# Altium schematic sheet NSSTC-BAK.SchDoc
size A4
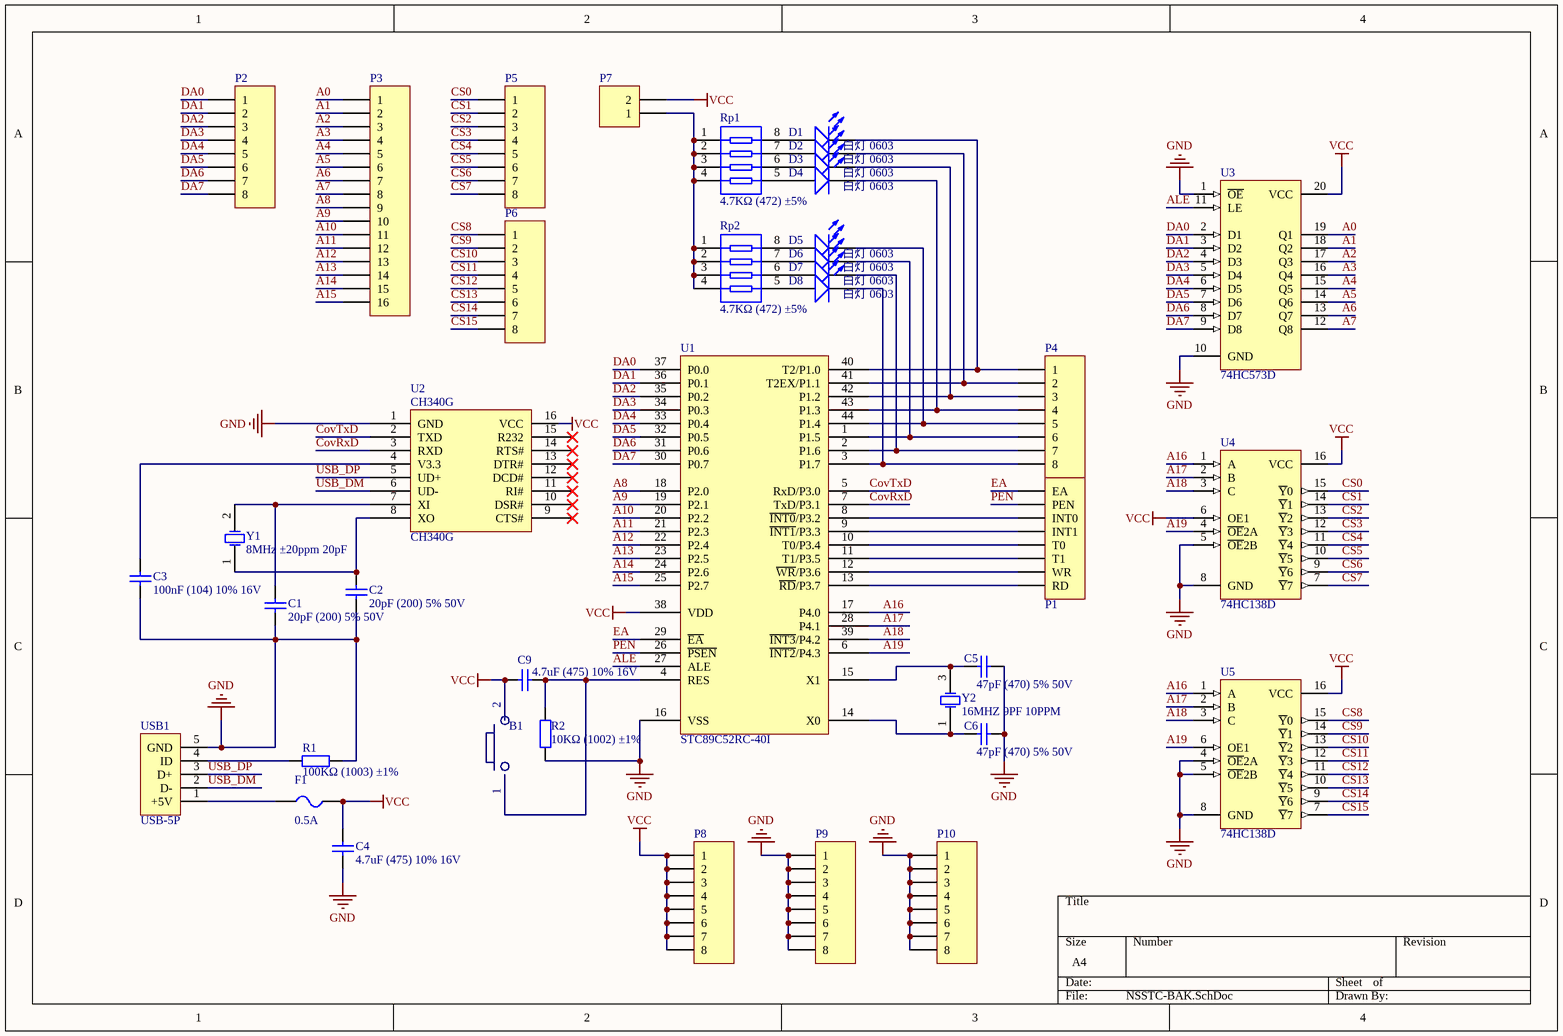
[diagram p0: NSSTC-BAK.SchDoc]

## Parts
B1  B?  [MetalButton]  (value not drawn)
C1  20pF (200) 5% 50V  [0402_C]
C2  20pF (200) 5% 50V  [0402_C]
C3  100nF (104) 10% 16V  [0402_C]
C4  4.7uF (475) 10% 16V  [0603_C]
C5  47pF (470) 5% 50V  [0402_C]
C6  47pF (470) 5% 50V  [0402_C]
C9  4.7uF (475) 10% 16V  [0603_C]
D1  白灯 0603  [0603_LED_S1]
D2  白灯 0603  [0603_LED_S1]
D3  白灯 0603  [0603_LED_S1]
D4  白灯 0603  [0603_LED_S1]
D5  白灯 0603  [0603_LED_S1]
D6  白灯 0603  [0603_LED_S1]
D7  白灯 0603  [0603_LED_S1]
D8  白灯 0603  [0603_LED_S1]
F1  0.5A  [FU 0603]
P1  Header 8  [HDR1X8]  (value not drawn)
P2  Header 8  [HDR1X8]  (value not drawn)
P3  Header 16  [HDR1X16]  (value not drawn)
P4  Header 8  [HDR1X8]  (value not drawn)
P5  Header 8  [HDR1X8]  (value not drawn)
P6  Header 8  [HDR1X8]  (value not drawn)
P7  Header 2  [HDR1X2]  (value not drawn)
P8  Header 8  [HDR1X8]  (value not drawn)
P9  Header 8  [HDR1X8]  (value not drawn)
P10  Header 8  [HDR1X8]  (value not drawn)
R1  100KΩ (1003) ±1%  [0402_R]
R2  10KΩ (1002) ±1%  [0402_R]
Rp1  4.7KΩ (472) ±5%  [0603_Rx4]
Rp2  4.7KΩ (472) ±5%  [0603_Rx4]
U1  STC89C52RC-40I  [LQFP-44_10x10x08P]
U2  CH340G  [SOIC-16_150mil]
U3  74HC573D  [SOIC-20_300mil]
U4  74HC138D  [SOIC-16_150mil]
U5  74HC138D  [SOIC-16_150mil]
USB1  USB-5P  [USB-MICRO_D]
Y1  8MHz ±20ppm 20pF  [SMD-5032_2P]
Y2  16MHZ 9PF 10PPM  [SMD-3225_4P]

## Nets
GND: C1.1 C2.1 C3.1 C4.1 C5.2 C6.2 P9.1 P9.2 P9.3 P9.4 P9.5 P9.6 P9.7 P9.8 P10.1 P10.2 P10.3 P10.4 P10.5 P10.6 P10.7 P10.8 R1.2 R2.1 U1.16(VSS) U2.1(GND) U3.1(~{OE}) U3.10(GND) U4.5(~{OE}2B) U4.8(GND) U5.4(~{OE}2A) U5.5(~{OE}2B) U5.8(GND) USB1.5(GND)
VCC: B1.2 C4.2 C9.2 F1.1 P7.2 P8.1 P8.2 P8.3 P8.4 P8.5 P8.6 P8.7 P8.8 U1.38(VDD) U2.16(VCC) U3.20(VCC) U4.6(OE1) U4.16(VCC) U5.16(VCC)
A0: P3.1 U3.19(Q1)
A1: P3.2 U3.18(Q2)
A2: P3.3 U3.17(Q3)
A3: P3.4 U3.16(Q4)
A4: P3.5 U3.15(Q5)
A5: P3.6 U3.14(Q6)
A6: P3.7 U3.13(Q7)
A7: P3.8 U3.12(Q8)
A8: P3.9 U1.18(P2.0)
A9: P3.10 U1.19(P2.1)
A10: P3.11 U1.20(P2.2)
A11: P3.12 U1.21(P2.3)
A12: P3.13 U1.22(P2.4)
A13: P3.14 U1.23(P2.5)
A14: P3.15 U1.24(P2.6)
A15: P3.16 U1.25(P2.7)
A16: U1.17(P4.0) U4.1(A) U5.1(A)
A17: U1.28(P4.1) U4.2(B) U5.2(B)
A18: U1.39(~{INT3}/P4.2) U4.3(C) U5.3(C)
A19: U1.6(~{INT2}/P4.3) U4.4(~{OE}2A) U5.6(OE1)
ALE: U1.27(ALE) U3.11(LE)
CovRxD: U1.7(TxD/P3.1) U2.3(RXD)
CovTxD: U1.5(RxD/P3.0) U2.2(TXD)
CS0: P5.1 U4.15(~{Y}0)
CS1: P5.2 U4.14(~{Y}1)
CS2: P5.3 U4.13(~{Y}2)
CS3: P5.4 U4.12(~{Y}3)
CS4: P5.5 U4.11(~{Y}4)
CS5: P5.6 U4.10(~{Y}5)
CS6: P5.7 U4.9(~{Y}6)
CS7: P5.8 U4.7(~{Y}7)
CS8: P6.1 U5.15(~{Y}0)
CS9: P6.2 U5.14(~{Y}1)
CS10: P6.3 U5.13(~{Y}2)
CS11: P6.4 U5.12(~{Y}3)
CS12: P6.5 U5.11(~{Y}4)
CS13: P6.6 U5.10(~{Y}5)
CS14: P6.7 U5.9(~{Y}6)
CS15: P6.8 U5.7(~{Y}7)
DA0: P2.1 U1.37(P0.0) U3.2(D1)
DA1: P2.2 U1.36(P0.1) U3.3(D2)
DA2: P2.3 U1.35(P0.2) U3.4(D3)
DA3: P2.4 U1.34(P0.3) U3.5(D4)
DA4: P2.5 U1.33(P0.4) U3.6(D5)
DA5: P2.6 U1.32(P0.5) U3.7(D6)
DA6: P2.7 U1.31(P0.6) U3.8(D7)
DA7: P2.8 U1.30(P0.7) U3.9(D8)
EA: P1.1(EA) U1.29(~{EA})
PEN: P1.2(PEN) U1.26(~{PSEN})
USB_DM: U2.6(UD-) USB1.2(D-)
USB_DP: U2.5(UD+) USB1.3(D+)
NetB1_1: B1.1 C9.1 R2.2 U1.4(RES)
NetC1_2: C1.2 U2.7(XI) Y1.2(OSC2)
NetC2_2: C2.2 U2.8(XO) Y1.1(OSC1)
NetC3_2: C3.2 U2.4(V3.3)
NetC5_1: C5.1 U1.15(X1) Y2.3(OSC2)
NetC6_1: C6.1 U1.14(X0) Y2.1(OSC1)
NetD1_A: D1.A Rp1.8
NetD1_K: D1.K P4.1 U1.40(T2/P1.0)
NetD2_A: D2.A Rp1.7
NetD2_K: D2.K P4.2 U1.41(T2EX/P1.1)
NetD3_A: D3.A Rp1.6
NetD3_K: D3.K P4.3 U1.42(P1.2)
NetD4_A: D4.A Rp1.5
NetD4_K: D4.K P4.4 U1.43(P1.3)
NetD5_A: D5.A Rp2.8
NetD5_K: D5.K P4.5 U1.44(P1.4)
NetD6_A: D6.A Rp2.7
NetD6_K: D6.K P4.6 U1.1(P1.5)
NetD7_A: D7.A Rp2.6
NetD7_K: D7.K P4.7 U1.2(P1.6)
NetD8_A: D8.A Rp2.5
NetD8_K: D8.K P4.8 U1.3(P1.7)
NetF1_2: F1.2 USB1.1(+5V)
NetP1_3: P1.3(INT0) U1.8(~{INT0}/P3.2)
NetP1_4: P1.4(INT1) U1.9(~{INT1}/P3.3)
NetP1_5: P1.5(T0) U1.10(T0/P3.4)
NetP1_6: P1.6(T1) U1.11(T1/P3.5)
NetP1_7: P1.7(WR) U1.12(~{WR}/P3.6)
NetP1_8: P1.8(RD) U1.13(~{RD}/P3.7)
NetP7_1: P7.1 Rp1.1 Rp1.2 Rp1.3 Rp1.4 Rp2.1 Rp2.2 Rp2.3 Rp2.4
NetR1_1: R1.1 USB1.4(ID)

Not connected (* = marked no-connect by the designer): U2 9(CTS#)* 10(DSR#)* 11(RI#)* 12(DCD#)* 13(DTR#)* 14(RTS#)* 15(R232)*

## Library data of the parts
B1 = MetalButton
C1 C2 = 0402 20pF (200) 5% 50V: 贴片电容; ComponentLink1Description: 供应商链接; ComponentLink1URL: http://www.szlcsc.com/product/details_1906.html; Package: 0402; Supplier: LC; SuppliersPartNumber: C1554
C3 = 0402 100nF (104) 10% 16V: 贴片电容; ComponentLink1Description: 供应商链接; ComponentLink1URL: http://www.szlcsc.com/product/details_1877.html; Package: 0402; Supplier: LC; SuppliersPartNumber: C1525
C4 C9 = 0603 4.7uF (475) 10% 16V: 贴片电容; ComponentLink1Description: 供应商链接; ComponentLink1URL: http://www.szlcsc.com/product/details_20375.html; Package: 0603; Supplier: LC; SuppliersPartNumber: C19666
C5 C6 = 0402 47pF (470) 5% 50V: 贴片电容; ComponentLink1Description: 供应商链接; ComponentLink1URL: http://www.szlcsc.com/product/details_1919.html; Package: 0402; Supplier: LC; SuppliersPartNumber: C1567
D1-D8 = 0603 白灯: 发光二极管; ComponentLink1Description: 供应商链接; ComponentLink1URL: http://www.szlcsc.com/product/details_2663.html; Package: 0603; Supplier: LC; SuppliersPartNumber: C2290
F1 = FU: 贴片保险丝; 版权归属: 源创客; BOM名称: 贴片保险丝; 学习资源: www.ooocke.com
P1 P2 P4-P6 P8-P10 = Header 8: Header, 8-Pin; LatestRevisionDate: 17-Jul-2002; LatestRevisionNote: Re-released for DXP Platform.; Publisher: Altium Limited
P3 = Header 16: Header, 16-Pin; LatestRevisionDate: 17-Jul-2002; LatestRevisionNote: Re-released for DXP Platform.; Publisher: Altium Limited
P7 = Header 2: Header, 2-Pin; LatestRevisionDate: 17-Jul-2002; LatestRevisionNote: Re-released for DXP Platform.; Publisher: Altium Limited
R1 = 0402 100KΩ (1003) 1%: 贴片电阻; ComponentLink1Description: 供应商链接; ComponentLink1URL: http://www.szlcsc.com/product/details_26484.html; Package: 0402; Supplier: LC; SuppliersPartNumber: C25741
R2 = 0402 10KΩ (1002) 1%: 贴片电阻; ComponentLink1Description: 供应商链接; ComponentLink1URL: http://www.szlcsc.com/product/details_26487.html; Package: 0402; Supplier: LC; SuppliersPartNumber: C25744
Rp1 Rp2 = 0603*4  4.7KΩ (472) 5%: 贴片排阻; ComponentLink1Description: 供应商链接; ComponentLink1URL: http://www.szlcsc.com/product/details_2332.html; Package: 0603*4; Supplier: LC; SuppliersPartNumber: C1980
U1 = STC89C52RC-40I: MCU; ComponentLink1Description: 供应商链接; ComponentLink1URL: http://www.szlcsc.com/product/details_9213.html; Package: LQFP-44_10x10x08P; Supplier: LC; SuppliersPartNumber: C8707
U2 = CH340G_[C14267]: USB; ComponentLink1Description: 供应商链接; ComponentLink1URL: http://www.szlcsc.com/product/details_14927.html; Package: SOIC-16_150mil; Supplier: LC; SuppliersPartNumber: C14267
U3 = 74HC573D_[C5608]: 74系列逻辑芯片; ComponentLink1Description: 供应商链接; ComponentLink1URL: http://www.szlcsc.com/product/details_6059.html; Package: SOIC-20_300mil; Supplier: LC; SuppliersPartNumber: C5608
U4 U5 = 74HC138D_[C5602]: 74系列逻辑芯片; ComponentLink1Description: 供应商链接; ComponentLink1URL: http://www.szlcsc.com/product/details_6053.html; Package: SOIC-16_150mil; Supplier: LC; SuppliersPartNumber: C5602
USB1 = USB-5P: 微型USB母座; 版权归属: 源创客; BOM名称: 微型USB母座; 学习资源: www.ooocke.com
Y1 = SMD-5032_2P 8MHz 20ppm 20pF: 贴片晶振; ComponentLink1Description: 供应商链接; ComponentLink1URL: http://www.szlcsc.com/product/details_117214.html; Package: SMD-5032_2P; Supplier: LC; SuppliersPartNumber: C115962
Y2 = SMD-3225_4P  16MHZ 9PF 10PPM: 贴片晶振; ComponentLink1Description: 供应商链接; ComponentLink1URL: http://www.szlcsc.com/product/details_14393.html; Package: SMD-3225_4P; Supplier: LC; SuppliersPartNumber: C13738